# Altium schematic sheet 27_WR_PTP.SchDoc: White Rabbit PTP
size A3; Organization: Lime Microsystems; Address1: Surrey Tech Centre; Address2: Guildford GU2 7YG; Address3: Surrey; Address4: United Kingdom; DocumentNumber: 16; Revision: v1.0; SheetNumber: 27; SheetTotal: 31
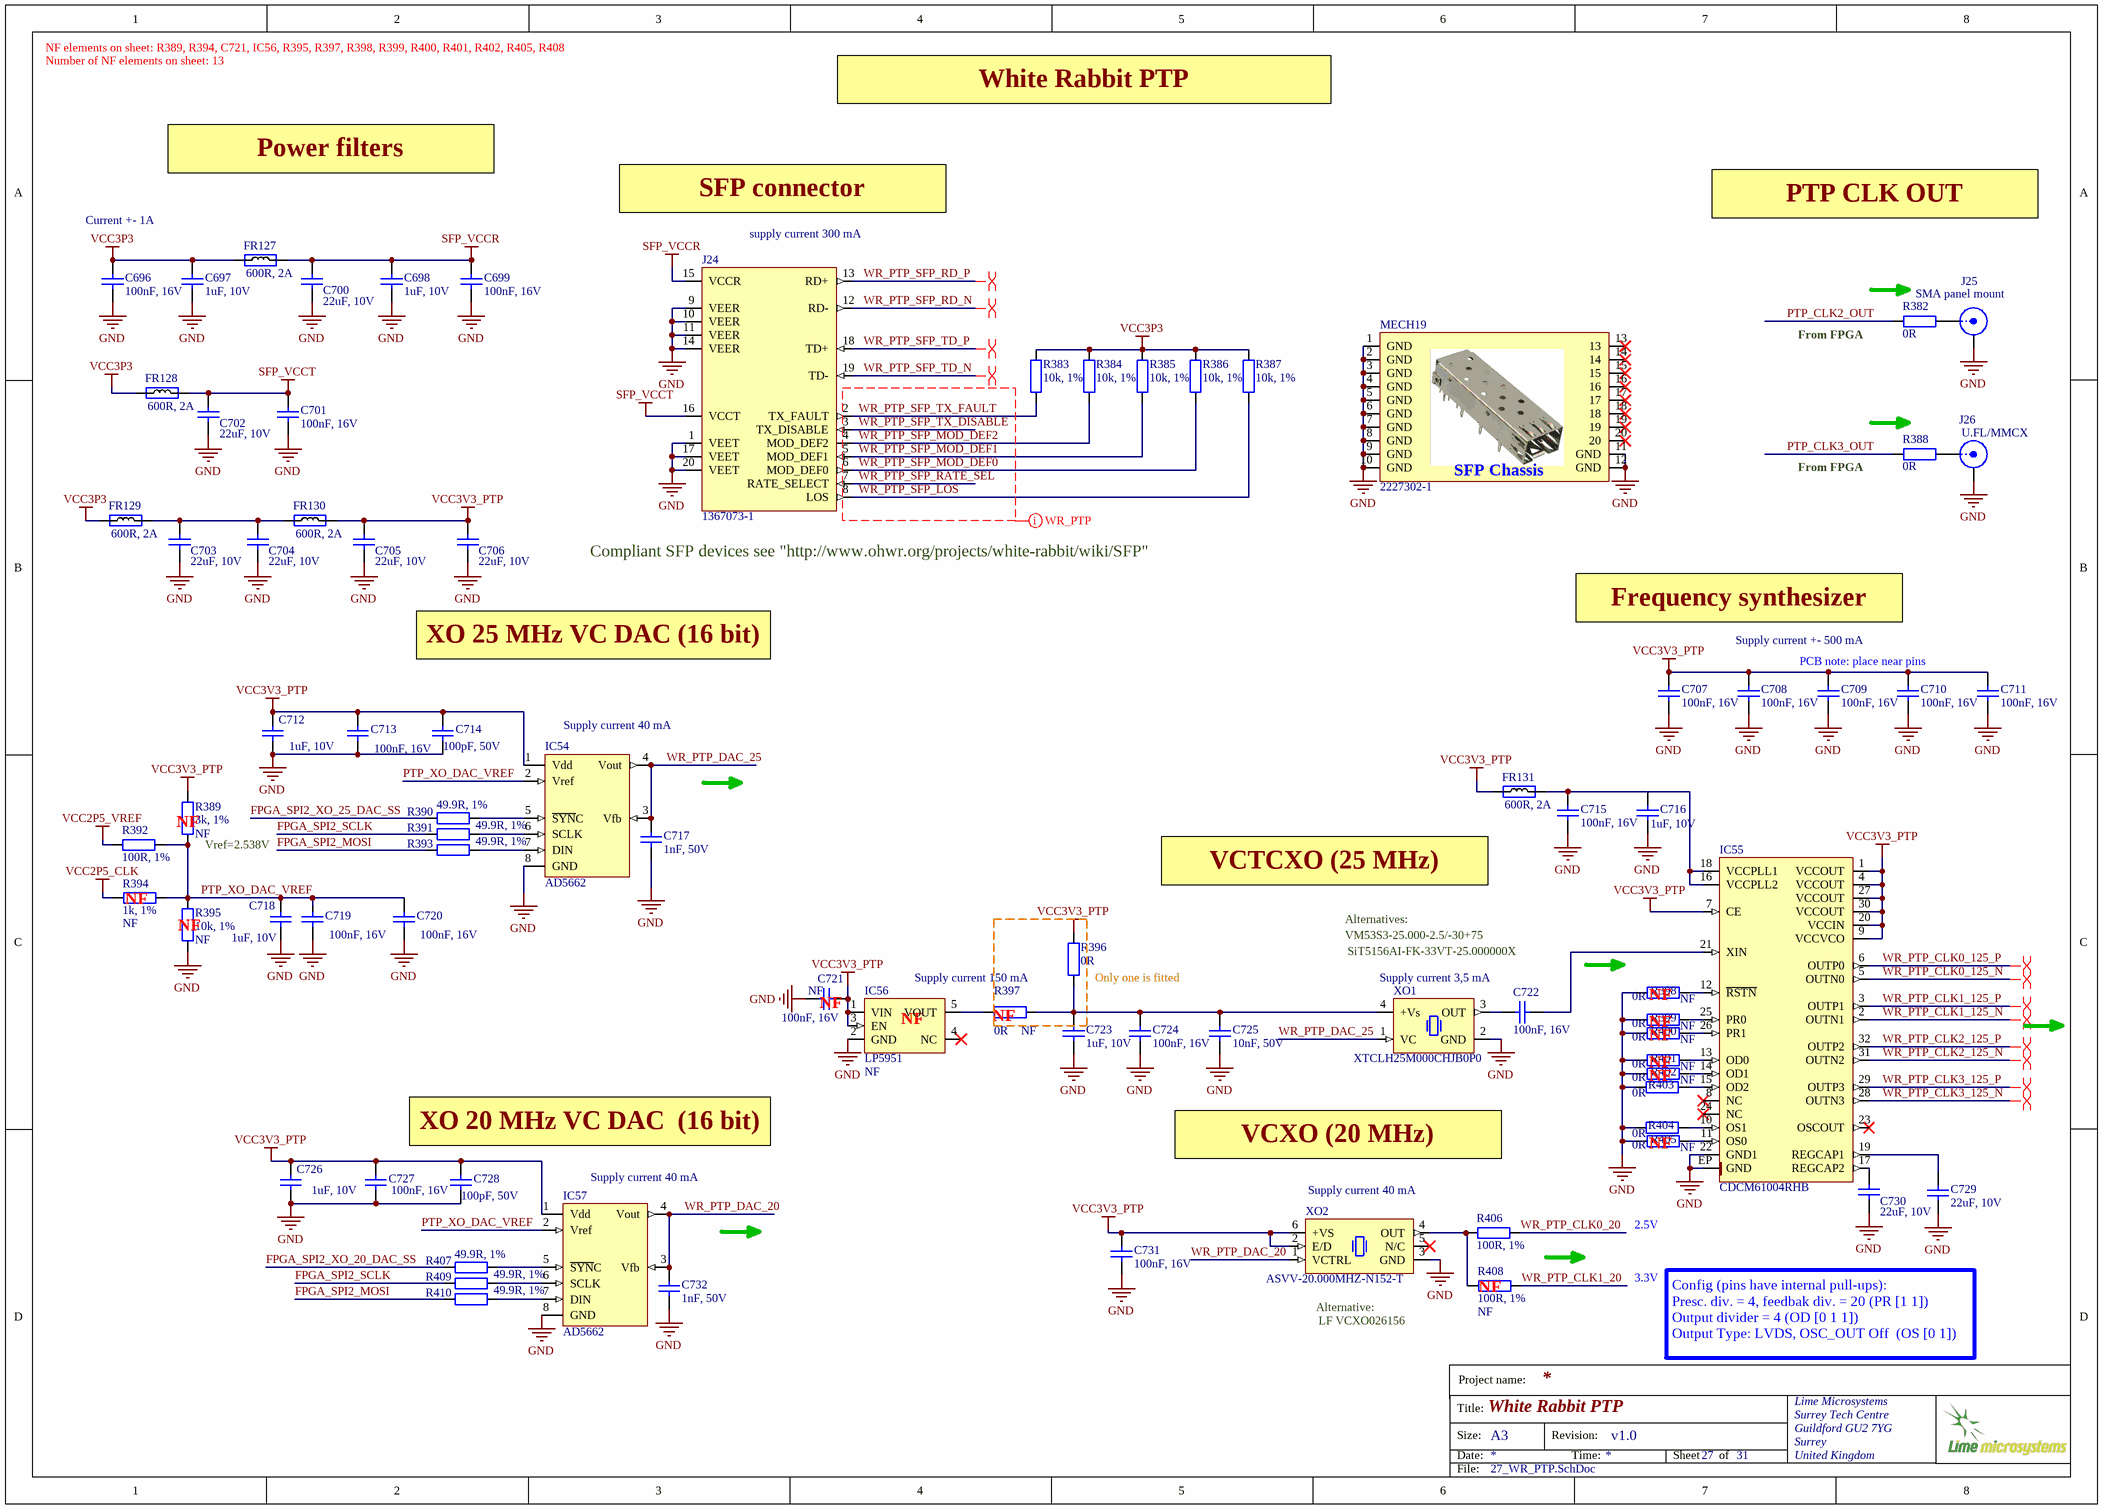
[diagram p0: 27_WR_PTP.SchDoc]

## Parts
C696  100nF, 16V  [CAP0402]
C697  1uF, 10V  [CAP0402]
C698  1uF, 10V  [CAP0402]
C699  100nF, 16V  [CAP0402]
C700  22uF, 10V  [CAP0603]
C701  100nF, 16V  [CAP0402]
C702  22uF, 10V  [CAP0603]
C703  22uF, 10V  [CAP0603]
C704  22uF, 10V  [CAP0603]
C705  22uF, 10V  [CAP0603]
C706  22uF, 10V  [CAP0603]
C707  100nF, 16V  [CAP0402]
C708  100nF, 16V  [CAP0402]
C709  100nF, 16V  [CAP0402]
C710  100nF, 16V  [CAP0402]
C711  100nF, 16V  [CAP0402]
C712  1uF, 10V  [CAP0402]
C713  100nF, 16V  [CAP0402]
C714  100pF, 50V  [CAP0402]
C715  100nF, 16V  [CAP0402]
C716  1uF, 10V  [CAP0402]
C717  1nF, 50V  [CAP0402]
C718  1uF, 10V  [CAP0402]
C719  100nF, 16V  [CAP0402]
C720  100nF, 16V  [CAP0402]
C721  100nF, 16V  Assembly Info: NF  [CAP0402]
C722  100nF, 16V  [CAP0402]
C723  1uF, 10V  [CAP0402]
C724  100nF, 16V  [CAP0402]
C725  10nF, 50V  [CAP0402]
C726  1uF, 10V  [CAP0402]
C727  100nF, 16V  [CAP0402]
C728  100pF, 50V  [CAP0402]
C729  22uF, 10V  [CAP0603]
C730  22uF, 10V  [CAP0603]
C731  100nF, 16V  [CAP0402]
C732  1nF, 50V  [CAP0402]
FR127  600R, 2A  [RES0805]
FR128  600R, 2A  [RES0805]
FR129  600R, 2A  [RES0805]
FR130  600R, 2A  [RES0805]
FR131  600R, 2A  [RES0805]
IC54  AD5662  [AD5662_SOT23-8]
IC55  CDCM61004RHB  [CDCM61004RHB_CLK_GEN_VQFN32]
IC56  LP5951  Assembly Info: NF  [LP5951MF_SOT23-5]
IC57  AD5662  [AD5662_SOT23-8]
J24  1367073-1  [SFP_CON_x1_1367073-1]
J25  SMA panel mount  [SMA_connector_side]
J26  U.FL/MMCX  [MMCX_UFL_conn_u]
MECH19  2227302-1  [SFP_Chassis_22273021]
R382  0R  [RES0402]
R383  10k, 1%  [RES0402]
R384  10k, 1%  [RES0402]
R385  10k, 1%  [RES0402]
R386  10k, 1%  [RES0402]
R387  10k, 1%  [RES0402]
R388  0R  [RES0402]
R389  3k, 1%  Assembly Info: NF  [RES0402]
R390  49.9R, 1%  [RES0402]
R391  49.9R, 1%  [RES0402]
R392  100R, 1%  [RES0402]
R393  49.9R, 1%  [RES0402]
R394  1k, 1%  Assembly Info: NF  [RES0402]
R395  10k, 1%  Assembly Info: NF  [RES0402]
R396  0R  [RES0402]
R397  0R  Assembly Info: NF  [RES0402]
R398  0R  Assembly Info: NF  [RES0402]
R399  0R  Assembly Info: NF  [RES0402]
R400  0R  Assembly Info: NF  [RES0402]
R401  0R  Assembly Info: NF  [RES0402]
R402  0R  Assembly Info: NF  [RES0402]
R403  0R  [RES0402]
R404  0R  [RES0402]
R405  0R  Assembly Info: NF  [RES0402]
R406  100R, 1%  [RES0402]
R407  49.9R, 1%  [RES0402]
R408  100R, 1%  Assembly Info: NF  [RES0402]
R409  49.9R, 1%  [RES0402]
R410  49.9R, 1%  [RES0402]
XO1  XTCLH25M000CHJB0P0  [XO_XTCLH25M000CHJB0P0]
XO2  ASVV-20.000MHZ-N152-T  [XO_ASVV-20.000MHZ-N152-T]

## Nets
GND: C696.1 C697.1 C698.1 C699.1 C700.1 C701.1 C702.1 C703.1 C704.1 C705.1 C706.1 C707.1 C708.1 C709.1 C710.1 C711.1 C712.1 C713.2 C714.2 C715.1 C716.1 C717.2 C718.1 C719.2 C720.2 C721.1 C723.1 C724.1 C725.2 C726.1 C727.2 C728.2 C729.2 C730.1 C731.1 C732.2 IC54.8(GND) IC55.22(GND1) IC55.EP(GND) IC56.2(GND) IC57.8(GND) J24.1(VEET) J24.9(VEER) J24.10(VEER) J24.11(VEER) J24.14(VEER) J24.17(VEET) J24.20(VEET) J25.2(Y) J26.2(Y) MECH19.1(GND) MECH19.2(GND) MECH19.3(GND) MECH19.4(GND) MECH19.5(GND) MECH19.6(GND) MECH19.7(GND) MECH19.8(GND) MECH19.9(GND) MECH19.10(GND) MECH19.11(GND) MECH19.12(GND) R395.2 R398.2 R399.2 R400.2 R401.2 R402.2 R403.1 R404.1 R405.2 XO1.2(GND) XO2.3(GND)
SFP_VCCR: C698.2 C699.2 C700.2 FR127.2 J24.15(VCCR)
SFP_VCCT: C701.2 C702.2 FR128.2 J24.16(VCCT)
VCC2P5_CLK: R394.2
VCC2P5_VREF: R392.1
VCC3P3: C696.2 C697.2 FR127.1 FR128.1 FR129.1 R383.1 R384.1 R385.1 R386.1 R387.1
VCC3V3_PTP: C705.2 C706.2 C707.2 C708.2 C709.2 C710.2 C711.2 C712.2 C713.1 C714.1 C721.2 C726.2 C727.1 C728.1 C731.2 FR130.2 FR131.1 IC54.1(Vdd) IC55.1(VCCOUT) IC55.4(VCCOUT) IC55.7(CE) IC55.9(VCCVCO) IC55.20(VCCIN) IC55.27(VCCOUT) IC55.30(VCCOUT) IC56.1(VIN) IC56.3(EN) IC57.1(Vdd) R389.2 R396.1 XO2.2(E/D) XO2.6(+VS)
FPGA_SPI2_MOSI: R393.2 R410.2
FPGA_SPI2_SCLK: R391.2 R409.2
FPGA_SPI2_XO_20_DAC_SS: R407.2
FPGA_SPI2_XO_25_DAC_SS: R390.2
PTP_CLK2_OUT: R382.2
PTP_CLK3_OUT: R388.2
PTP_XO_DAC_VREF: C718.2 C719.1 C720.1 IC54.2(Vref) IC57.2(Vref) R389.1 R392.2 R394.1 R395.1
WR_PTP_CLK0_20: R406.1
WR_PTP_CLK0_125_N: IC55.5(OUTN0)
WR_PTP_CLK0_125_P: IC55.6(OUTP0)
WR_PTP_CLK1_20: R408.1
WR_PTP_CLK1_125_N: IC55.2(OUTN1)
WR_PTP_CLK1_125_P: IC55.3(OUTP1)
WR_PTP_CLK2_125_N: IC55.31(OUTN2)
WR_PTP_CLK2_125_P: IC55.32(OUTP2)
WR_PTP_CLK3_125_N: IC55.28(OUTN3)
WR_PTP_CLK3_125_P: IC55.29(OUTP3)
WR_PTP_DAC_20: C732.1 IC57.3(Vfb) IC57.4(Vout) XO2.1(VCTRL)
WR_PTP_DAC_25: C717.1 IC54.3(Vfb) IC54.4(Vout) XO1.1(VC)
WR_PTP_SFP_LOS: J24.8(LOS) R387.2
WR_PTP_SFP_MOD_DEF0: J24.6(MOD_DEF0) R386.2
WR_PTP_SFP_MOD_DEF1: J24.5(MOD_DEF1) R385.2
WR_PTP_SFP_MOD_DEF2: J24.4(MOD_DEF2) R384.2
WR_PTP_SFP_RATE_SEL: J24.7(RATE_SELECT)
WR_PTP_SFP_RD_N: J24.12(RD-)
WR_PTP_SFP_RD_P: J24.13(RD+)
WR_PTP_SFP_TD_N: J24.19(TD-)
WR_PTP_SFP_TD_P: J24.18(TD+)
WR_PTP_SFP_TX_DISABLE: J24.3(TX_DISABLE)
WR_PTP_SFP_TX_FAULT: J24.2(TX_FAULT) R383.2
NetC703_2: C703.2 C704.2 FR129.2 FR130.1
NetC715_2: C715.2 C716.2 FR131.2 IC55.16(VCCPLL2) IC55.18(VCCPLL1)
NetC722_1: C722.1 IC55.21(XIN)
NetC722_2: C722.2 XO1.3(OUT)
NetC723_2: C723.2 C724.2 C725.1 R396.2 R397.1 XO1.4(+Vs)
NetC729_1: C729.1 IC55.19(REGCAP1)
NetC730_2: C730.2 IC55.17(REGCAP2)
NetIC54_5: IC54.5(~{SYN}C) R390.1
NetIC54_6: IC54.6(SCLK) R391.1
NetIC54_7: IC54.7(DIN) R393.1
NetIC55_10: IC55.10(OS1) R404.2
NetIC55_11: IC55.11(OS0) R405.1
NetIC55_12: IC55.12(~{RSTN}) R398.1
NetIC55_13: IC55.13(OD0) R401.1
NetIC55_14: IC55.14(OD1) R402.1
NetIC55_15: IC55.15(OD2) R403.2
NetIC55_25: IC55.25(PR0) R399.1
NetIC55_26: IC55.26(PR1) R400.1
NetIC56_5: IC56.5(VOUT) R397.2
NetIC57_5: IC57.5(~{SYN}C) R407.1
NetIC57_6: IC57.6(SCLK) R409.1
NetIC57_7: IC57.7(DIN) R410.1
NetJ25_1: J25.1(X) R382.1
NetJ26_1: J26.1(X) R388.1
NetR406_2: R406.2 R408.2 XO2.4(OUT)

Not connected (* = marked no-connect by the designer): IC55 8(NC)* 23(OSCOUT)* 24(NC)*; IC56 4(NC)*; MECH19 13* 14* 15* 16* 17* 18* 19* 20*; XO2 5(N/C)*

## Layout directives
differential pair: WR_PTP_CLK0_125_N, WR_PTP_CLK0_125_P, WR_PTP_CLK1_125_N, WR_PTP_CLK1_125_P, WR_PTP_CLK2_125_N, WR_PTP_CLK2_125_P, WR_PTP_CLK3_125_N, WR_PTP_CLK3_125_P, WR_PTP_SFP_RD_N, WR_PTP_SFP_RD_P, WR_PTP_SFP_TD_N, WR_PTP_SFP_TD_P
net class WR_PTP: WR_PTP_SFP_LOS, WR_PTP_SFP_MOD_DEF0, WR_PTP_SFP_MOD_DEF1, WR_PTP_SFP_MOD_DEF2, WR_PTP_SFP_RATE_SEL, WR_PTP_SFP_TX_DISABLE, WR_PTP_SFP_TX_FAULT

## Notes on the sheet
- Number of NF elements on sheet: 13
- NF elements on sheet: R389, R394, C721, IC56, R395, R397, R398, R399, R400, R401, R402, R405, R408
- White Rabbit PTP
- Power filters
- Current +- 1A
- SFP connector
- (near J24) supply current 300 mA
- PTP CLK OUT
- (near R382) From FPGA
- (near MECH19) SFP Chassis
- (near R388) From FPGA
- (near J24) Compliant SFP devices see "http://www.ohwr.org/projects/white-rabbit/wiki/SFP"
- XO 25 MHz VC DAC (16 bit)
- Frequency synthesizer
- Supply current +- 500 mA
- PCB note: place near pins
- (near IC54) Supply current 40 mA
- (near R389) NF
- (near R389) Vref=2.538V
- (near R394) NF
- (near FR131) VCTCXO (25 MHz)
- Alternatives:
- (near R395) NF
- Supply current 150 mA
- (near R396) Only one is fitted
- VM53S3-25.000-2.5/-30+75
- SiT5156AI-FK-33VT-25.000000X
- Supply current 3,5 mA
- (near C721) NF
- (near IC56) NF
- (near R397) NF
- (near R398) NF
- NF
- XO 20 MHz VC DAC  (16 bit)
- (near IC57) Supply current 40 mA
- VCXO (20 MHz)
- (near XO2) Supply current 40 mA
- 2.5V
- (near XO2) Alternative:
- LF VCXO026156
- (near R408) NF
- 3.3V
- Config (pins have internal pull-ups):
  Presc. div. = 4, feedbak div. = 20 (PR [1 1])
  Output divider = 4 (OD [0 1 1])
  Output Type: LVDS, OSC_OUT Off  (OS [0 1])
- Project name:
- Title:
- Size:
- Date:
- A3
- Revision:
- Time:
- Sheet
- of
- File:

## Library data of the parts
C696 C699 C701 C707-C711 C715 C721 C722 C724 C731 = Cap_0402: Manufacturer: Murata Electronics; Manufacturer Part Number 1: GRM155R71C104KA88D; Part Description: 0.10µF ±10% 16V X7R Ceramic Capacitor -55°C ~ 125°C Surface Mount, MLCC 0402 (1005 Metric) 0.039" L x 0.020" W (1.00mm x 0.50mm); Tolerance: 10 %; Type: General Purpose MLCC; Capacitance: 0.1 uF; Case Length: 1 mm; Dielectric: X7R; Case Height: 0.5 mm; Temperature Coefficient / Code: +/- 15 %; Value: 100nF, 16V; Supplier 1: Mouser; Supplier Part Number 1: 81-GRM155R71C104KA88; Case Code - in: 0402; RoHS: RoHS Compliant; Operating Temperature Range: - 55 C to + 125 C; Series: GRM; Termination Style: SMD/SMT; Package / Case: 0402 (1005 metric); Voltage Rating DC: 16 V; Maximum Operating Temperature: + 125 C; Case Code - mm: 1005; Minimum Operating Temperature: - 55 C; Product Category: Low & Medium Capacitance SMD Ceramic Chip Capacitors; Packaging: Reel; Product: General Type MLCCs; Category: Multilayer Ceramic Capacitors MLCC - SMD/SMT; Brand: Murata Electronics; Case Width: 0.5 mm; RoHS - Mouser: Y; Standard Pack Qty: 10000; Minimum Order Quantity: 1; Reeling: True
C697 C698 C712 C716 C718 C723 C726 = Cap_0402: Manufacturer Part Number 1: C1005X5R1E105K050BC; Manufacturer: TDK; Part Description: 1µF ±10% 10V X5R Ceramic Capacitor -55°C ~ 85°C Surface Mount, MLCC 0402 (1005 Metric) 0.039" L x 0.020" W (1.00mm x 0.50mm); Voltage Rating: 10; Capacitance: 1; Capacitance Tolerance: ± 10%; Ceramic Capacitor Case: 0402 [1005 Metric]; Dielectric Characteristic: X6; Product Range: TDK - C Series; Value: 1uF, 10V; Supplier 1: Digi-Key; Supplier Part Number 1: 445-9066-1-ND; MSL: -; RoHS: YES
C700 C702-C706 C729 C730 = Cap_0603: Manufacturer Part Number 1: C1608X5R1A226M080AC; Manufacturer: TDK Corporation; Part Description: 22µF ±20% 10V X5R Ceramic Capacitor -55°C ~ 85°C Surface Mount, MLCC 0603 (1608 Metric) 0.063" L x 0.031" W (1.60mm x 0.80mm); Brand: TDK; Temperature Coefficient / Code: +/- 15 %; Tolerance: 20 %; Type: Multilayer Ceramic Chip Capacitor; Supplier 1: Mouser; Supplier Part Number 1: 810-C1608X5R1A226M; Package / Case: 0603 (1608 metric); Category: Multilayer Ceramic Capacitors MLCC - SMD/SMT; Capacitance: 22 uF; Operating Temperature Range: - 55 C to + 85 C; Case Code - in: 0603; Voltage Rating DC: 10 V; Case Code - mm: 1608; Value: 22uF, 10V
C713 C719 C720 C727 = Cap_0603: Manufacturer Part Number 1: GRM155R71C104KA88D; Part Description: 0.10µF ±10% 16V X7R Ceramic Capacitor -55°C ~ 125°C Surface Mount, MLCC 0402 (1005 Metric) 0.039" L x 0.020" W (1.00mm x 0.50mm); Brand: Murata Electronics; Tolerance: 10 %; Type: General Purpose MLCC; Capacitance: 0.1 uF; Temperature Coefficient / Code: +/- 15 %; Case Height: 0.5 mm; Case Length: 1 mm; Dielectric: X7R; Supplier 1: Mouser; Supplier Part Number 1: 81-GRM155R71C104KA88; Case Code - in: 0402; Manufacturer: Murata Electronics; Category: Multilayer Ceramic Capacitors MLCC - SMD/SMT; Voltage Rating DC: 16 V; Value: 100nF, 16V; Case Code - mm: 1005; Case Width: 0.5 mm; Maximum Operating Temperature: + 125 C; Minimum Operating Temperature: - 55 C; Minimum Order Quantity: 1; Operating Temperature Range: - 55 C to + 125 C; Package / Case: 0402 (1005 metric); Packaging: Reel; Product: General Type MLCCs; Product Category: Low & Medium Capacitance SMD Ceramic Chip Capacitors; Reeling: True; RoHS - Mouser: Y; RoHS: RoHS Compliant; Series: GRM; Standard Pack Qty: 10000; Termination Style: SMD/SMT
C714 C728 = Cap_0402: Manufacturer: Yageo; Manufacturer Part Number 1: CC0402JRNPO9BN101; Part Description: 100pF ±5% 50V C0G, NP0 Ceramic Capacitor -55°C ~ 125°C Surface Mount, MLCC 0402 (1005 Metric) 0.039" L x 0.020" W (1.00mm x 0.50mm); Temperature Coefficient: C0G, NP0; Tolerance: ±5%; Value: 100pF, 50V; Supplier 1: Digi-Key; Supplier Part Number 1: 311-1024-1-ND; Category: Capacitors; Features: -; Operating Temperature: -55°C ~ 125°C; Capacitance: 100pF; Thickness (Max): 0.022" (0.55mm); RoHS: RoHS Compliant; Voltage - Rated: 50V; Lead Style: -; Ratings: -; Size / Dimension: 0.039" L x 0.020" W (1.00mm x 0.50mm); Height - Seated (Max): -; Applications: General Purpose; Package / Case: 0402 (1005 Metric); Lead Spacing: -; Packaging: Tape & Reel (TR); Mounting Type: Surface Mount, MLCC
C717 C732 = Cap_0402: Manufacturer Part Number 1: GCM155R71H102KA37D; Part Description: 1000pF ±10% 50V X7R Ceramic Capacitor -55°C ~ 125°C Surface Mount, MLCC 0402 (1005 Metric) 0.039" L x 0.020" W (1.00mm x 0.50mm); Capacitance: 1000 pF; Type: Automotive Ultra Small MLCC; Tolerance: 10 %; Brand: Murata Electronics; Case Height: 0.5 mm; Case Length: 1 mm; Dielectric: X7R; Temperature Coefficient / Code: +/- 15 %; Value: 1nF, 50V; Supplier 1: Mouser; Supplier Part Number 1: 81-GCM155R71H102KA7D; Case Code - in: 0402; Package / Case: 0402 (1005 metric); Termination Style: SMD/SMT; Packaging: Reel; Operating Temperature Range: - 55 C to + 125 C; Maximum Operating Temperature: + 125 C; Manufacturer: Murata Electronics; Category: Multilayer Ceramic Capacitors MLCC - SMD/SMT; RoHS: RoHS Compliant; Series: GCM; Case Width: 0.5 mm; Voltage Rating DC: 50 V; Case Code - mm: 1005; Product: Automotive MLCCs; Standard Pack Qty: 10000; Reeling: True; RoHS - Mouser: Y; Minimum Order Quantity: 1; Product Category: Automotive Ceramic Chip Capacitors; Minimum Operating Temperature: - 55 C
C725 = Cap_0402: Part Description: 10000pF ±10% 50V Ceramic Capacitor X7R 0402 (1005 Metric); Manufacturer: Murata Electronics North America; Manufacturer Part Number 1: GRM155R71H103KA88D; Tolerance: ±10%; Temperature Coefficient: X7R; Value: 10nF, 50V; Supplier 1: Digi-Key; Supplier Part Number 1: 490-4516-2-ND; RoHS: RoHS Compliant; Category: Capacitors; Stock 1: 10970000; Pricing 1: 10000=0.00185, 20000=0.00176, 30000=0.00167 (USD); Packaging: Tape & Reel (TR); Part Status: Active; Voltage - Rated: 50V; Operating Temperature: -55°C ~ 125°C; Features: -; Ratings: -; Applications: General Purpose; Mounting Type: Surface Mount, MLCC; Package / Case: 0402 (1005 Metric); Size / Dimension: 0.039" L x 0.020" W (1.00mm x 0.50mm); Height - Seated (Max): -; Thickness (Max): 0.022" (0.55mm); Lead Spacing: -; Lead Style: -; ComponentLink1URL: http://www.murata.com/~/media/webrenewal/support/library/catalog/products/capacitor/mlcc/c02e.ashx?la=en-us; ComponentLink1Description: http://www.murata.com/~/media/webrenewal/support/library/catalog/products/capacitor/mlcc/c02e.ashx?la=en-us
FR127-FR131 = Ferrite: Manufacturer Part Number 1: MPZ2012S601AT000; Manufacturer: TDK Corporation; Part Description: FERRITE BEAD 600 OHM 0805 1LN; Filter Type: Differential Mode - Single; Impedance @ Frequency: 600 Ohm @ 100MHz; DC Resistance (DCR): 100 mOhm Max; Supplier 1: Digi-Key; Supplier Part Number 1: 445-2206-2-ND; Mounting Type: Surface Mount; RoHS: RoHS Compliant; Height (Max): 0.041" (1.05mm); Packaging: Tape & Reel (TR); Category: Filters; Current Rating: 2A; Package / Case: 0805 (2012 Metric); Size / Dimension: 0.079" L x 0.049" W (2.00mm x 1.25mm); Value: 600R, 2A
IC54 IC57 = AD5662: Manufacturer: Analog Devices Inc.; Manufacturer Part Number 1: AD5662BRJZ-2REEL7; Part Description: IC DAC 16BIT BUFF V-OUT SOT23-8; Number of Bits: 16; Number of D/A Converters: 1; Settling Time: 10µs; Output Type: Voltage - Buffered; Differential Output: No; Data Interface: SPI, DSP; Reference Type: External; Voltage - Supply, Analog: 2.7 V ~ 5.5 V; INL/DNL (LSB): ±8, ±1 (Max); Architecture: String DAC; Supplier 1: Digi-Key; RoHS: RoHS Compliant; Category: Integrated Circuits (ICs); Stock 1: 2784; Pricing 1: 1=7.55, 10=6.821, 100=5.6469, 500=4.91722, 1000=4.28274 (USD); Packaging: Cut Tape (CT); Part Status: Active; Voltage - Supply, Digital: 2.7 V ~ 5.5 V; Operating Temperature: -40°C ~ 125°C; Package / Case: SOT-23-8; Supplier Device Package: SOT-23-8; ComponentLink1URL: http://www.analog.com/media/en/technical-documentation/data-sheets/AD5662.pdf; ComponentLink1Description: http://www.analog.com/media/en/technical-documentation/data-sheets/AD5662.pdf; Supplier Part Number 1: AD5662BRJZ-2REEL7CT-ND
IC55 = CDCM61004RHB_CLK_GEN: Part Description: Clock Generator IC 683.27MHz 32-VFQFN Exposed Pad; Manufacturer: Texas Instruments; Manufacturer Part Number 1: CDCM61004RHBT; Frequency: 683.28MHz; Number of Outputs: 4; Nominal Supply Current: 215mA; Number of Elements: 1; Min Supply Voltage: 3V; Max Supply Voltage: 3.6V; Operating Supply Voltage: 3.3V; Max Frequency: 683.27MHz; Operating Supply Current: 108mA; Max Supply Current: 65mA; Input: Crystal; Input Current: 200mA; Supplier 1: Digi-Key; Supplier Part Number 1: 296-24194-1-ND; Stock 1: 1415; Pricing 1: 1=9,06000, 10=8,18800, 25=7,80760, 100=6,77930 (USD); RoHS: Yes; Mount: Surface Mount; Case/Package: VQFN; Number of Pins: 32; Weight: 0.002547oz; Contact Plating: Gold; Min Operating Temperature: -40°C; Max Operating Temperature: 85°C; Packaging: Tape and Reel; Package Quantity: 1; Number of Circuits: 1; Termination: SMD/SMT; Length: 5mm; Width: 5mm; Height: 0.8mm; Radiation Hardening: No; REACH SVHC: No SVHC; Lead Free: Lead Free; RoHS Compliant: Yes; ComponentLink1URL: https://datasheet.ciiva.com/6677/cdcm61004-6677168.pdf?src-supplier=Digi-Key; ComponentLink1Description: https://datasheet.ciiva.com/6677/cdcm61004-6677168.pdf?src-supplier=Digi-Key; ComponentLink2URL: https://datasheet.ciiva.com/14247/cdcm61004-14247059.pdf?src-supplier=Avnet; ComponentLink2Description: https://datasheet.ciiva.com/14247/cdcm61004-14247059.pdf?src-supplier=Avnet; ComponentLink3URL: https://datasheet.ciiva.com/1138/1781794-1138868.pdf?src-supplier=Element14; ComponentLink3Description: https://datasheet.ciiva.com/1138/1781794-1138868.pdf?src-supplier=Element14; ComponentLink4URL: https://datasheet.ciiva.com/26033/cdcm61004-26033080.pdf?src-supplier=Avnet+Europe; ComponentLink4Description: https://datasheet.ciiva.com/26033/cdcm61004-26033080.pdf?src-supplier=Avnet+Europe; ComponentLink5URL: https://datasheet.ciiva.com/14247/cdcm61004-14247241.pdf?src-supplier=Avnet; ComponentLink5Description: https://datasheet.ciiva.com/14247/cdcm61004-14247241.pdf?src-supplier=Avnet; ComponentLink6URL: https://datasheet.ciiva.com/46396/1781794-46396315.pdf?src-supplier=Element14; ComponentLink6Description: https://datasheet.ciiva.com/46396/1781794-46396315.pdf?src-supplier=Element14; ComponentLink7URL: https://datasheet.ciiva.com/1141/cdcm61004-1141260.pdf?src-supplier=Farnell; ComponentLink7Description: https://datasheet.ciiva.com/1141/cdcm61004-1141260.pdf?src-supplier=Farnell; ComponentLink8URL: https://datasheet.ciiva.com/15153/getdatasheetpartid-226426-15153388.pdf?src-supplier=Verical; ComponentLink8Description: https://datasheet.ciiva.com/15153/getdatasheetpartid-226426-15153388.pdf?src-supplier=Verical; ComponentLink9URL: https://datasheet.ciiva.com/46433/1781794-46433420.pdf?src-supplier=Element14; ComponentLink9Description: https://datasheet.ciiva.com/46433/1781794-46433420.pdf?src-supplier=Element14; ComponentLink10URL: https://datasheet.ciiva.com/1200/cdcm61004-1200223.pdf?src-supplier=Digi-Key; ComponentLink10Description: https://datasheet.ciiva.com/1200/cdcm61004-1200223.pdf?src-supplier=Digi-Key
IC56 = LP5951_LDO: Part Description: Linear Voltage Regulator IC Output 150mA SOT-23-5; Manufacturer: TI National Semiconductor; Manufacturer Part Number 1: LP5951MF-3.0/NOPB; Max Output Current: 150mA; Output Voltage: 3V; Number of Outputs: 1; Min Input Voltage: 1.8V; Max Input Voltage: 5.5V; Dropout Voltage: 200mV; Min Output Voltage: 1.3V; Max Output Voltage: 3.7V; Polarity: Positive; Quiescent Current: 55uA; Accuracy: 2%; Output Type: Fixed,Adjustable; Supplier 1: Digi-Key; Supplier Part Number 1: LP5951MF-3.0/NOPBCT-ND; Stock 1: 8756; Pricing 1: 1=0,80000, 10=0,70000, 25=0,65720, 100=0,53640, 250=0,49820, 500=0,42400 (USD); RoHS: Yes; Mount: Surface Mount; Case/Package: SOT-23; Number of Pins: 5; Min Operating Temperature: -40°C; Max Operating Temperature: 125°C; Package Quantity: 1000; Output Current: 150mA; Packaging: Tape and Reel; Nominal Output Voltage: 3V; Max Supply Voltage: 5.5V; Min Supply Voltage: 1.8V; Termination: SMD/SMT; Output Voltage Accuracy: 2%; Length: 2.92mm; Width: 1.6mm; Height: 1.02mm; Radiation Hardening: No; REACH SVHC: No SVHC; Lead Free: Lead Free; RoHS Compliant: Yes; ComponentLink1URL: https://datasheet.ciiva.com/15111/getdatasheetpartid-86470-15111508.pdf?src-supplier=Verical; ComponentLink1Description: https://datasheet.ciiva.com/15111/getdatasheetpartid-86470-15111508.pdf?src-supplier=Verical; ComponentLink2URL: https://datasheet.ciiva.com/6598/lp5951-6598089.pdf?src-supplier=Digi-Key; ComponentLink2Description: https://datasheet.ciiva.com/6598/lp5951-6598089.pdf?src-supplier=Digi-Key; ComponentLink3URL: https://datasheet.ciiva.com/6598/lp5951-6598090.pdf?src-supplier=Digi-Key; ComponentLink3Description: https://datasheet.ciiva.com/6598/lp5951-6598090.pdf?src-supplier=Digi-Key; ComponentLink4URL: https://datasheet.ciiva.com/6598/lp5951-6598091.pdf?src-supplier=Digi-Key; ComponentLink4Description: https://datasheet.ciiva.com/6598/lp5951-6598091.pdf?src-supplier=Digi-Key; ComponentLink5URL: https://datasheet.ciiva.com/48777/1772311-48777743.pdf?src-supplier=Element14; ComponentLink5Description: https://datasheet.ciiva.com/48777/1772311-48777743.pdf?src-supplier=Element14
J24 = SFPx1_Connector: Manufacturer: TE Connectivity; Part Description: 20 Position SFP Receptacle Connector Solder Surface Mount, Right Angle; Connector Type: Receptacle,SFP; Number of Ports: 1; Gender: Female; Number of Contacts: 20; Data Rate: 4Gbps; Max Voltage Rating (AC): 120V; Pitch: 0.8mm; Plating Thickness: 0.38um; Supplier 1: Digi-Key; Supplier Part Number 1: A97430CT-ND; Manufacturer Part Number 1: 1367073-1; Stock 1: 16529; Pricing 1: 1=1,77000, 10=1,60800, 25=1,51000, 50=1,44440, 100=1,37870 (USD); RoHS: Yes; Mount: Surface Mount; Contact Material: Bronze,Gold; Contact Plating: Gold; Material: Polymer,Liquid Crystal Polymer; Housing Material: Polymer; Color: Black; Housing Color: Black; Min Operating Temperature: -55°C; Max Operating Temperature: 85°C; Package Quantity: 480; Packaging: Tape and Reel; Termination: SMD/SMT; Orientation: Right Angle; Number of Positions: 20; Number of Positions Loaded: 20; Length: 11.2mm; Depth: 7.4mm; Radiation Hardening: No; Lead Free: Lead Free; ELV: Compliant; REACH SVHC: Unknown; Flammability Rating: UL94 V-0; ComponentLink1URL: https://datasheet.ciiva.com/689/eng-cd-1367073-k-689473.pdf?src-supplier=Digi-Key; ComponentLink1Description: https://datasheet.ciiva.com/689/eng-cd-1367073-k-689473.pdf?src-supplier=Digi-Key; ComponentLink2URL: https://datasheet.ciiva.com/26824/getdatasheetpartid-111150-26824248.pdf?src-supplier=Verical; ComponentLink2Description: https://datasheet.ciiva.com/26824/getdatasheetpartid-111150-26824248.pdf?src-supplier=Verical; ComponentLink3URL: https://datasheet.ciiva.com/16314/eng-cs-1773408-1-pluggable-ixo-solutions-sfp-0409-16314846.pdf?src-supplier=Future+Electronics; ComponentLink3Description: https://datasheet.ciiva.com/16314/eng-cs-1773408-1-pluggable-ixo-solutions-sfp-0409-16314846.pdf?src-supplier=Future+Electronics; ComponentLink4URL: https://datasheet.ciiva.com/14159/1367073-eng-tds-14159446.pdf?src-supplier=Distrelec; ComponentLink4Description: https://datasheet.ciiva.com/14159/1367073-eng-tds-14159446.pdf?src-supplier=Distrelec; ComponentLink5URL: https://datasheet.ciiva.com/11757/0900766b80db5732-11757313.pdf?src-supplier=RSComponents; ComponentLink5Description: https://datasheet.ciiva.com/11757/0900766b80db5732-11757313.pdf?src-supplier=RSComponents; ComponentLink6URL: https://datasheet.ciiva.com/1099/1509426-1099442.pdf?src-supplier=Newark; ComponentLink6Description: https://datasheet.ciiva.com/1099/1509426-1099442.pdf?src-supplier=Newark; ComponentLink7URL: https://datasheet.ciiva.com/689/eng-cd-1367073-k-689475.pdf?src-supplier=Digi-Key; ComponentLink7Description: https://datasheet.ciiva.com/689/eng-cd-1367073-k-689475.pdf?src-supplier=Digi-Key; ComponentLink8URL: https://datasheet.ciiva.com/1098/1650946-1098067.pdf?src-supplier=Element14; ComponentLink8Description: https://datasheet.ciiva.com/1098/1650946-1098067.pdf?src-supplier=Element14; ComponentLink9URL: https://datasheet.ciiva.com/3138/eng-cs-1773408-1-pluggable-ixo-solutions-sfp-0409-3138613.pdf?src-supplier=Avnet; ComponentLink9Description: https://datasheet.ciiva.com/3138/eng-cs-1773408-1-pluggable-ixo-solutions-sfp-0409-3138613.pdf?src-supplier=Avnet; ComponentLink10URL: https://datasheet.ciiva.com/3138/eng-cs-1773408-1-pluggable-ixo-solutions-sfp-0409-3138614.pdf?src-supplier=Avnet; ComponentLink10Description: https://datasheet.ciiva.com/3138/eng-cs-1773408-1-pluggable-ixo-solutions-sfp-0409-3138614.pdf?src-supplier=Avnet; ComponentLink11URL: https://datasheet.ciiva.com/689/eng-cd-1367073-k-689474.pdf?src-supplier=Digi-Key; ComponentLink11Description: https://datasheet.ciiva.com/689/eng-cd-1367073-k-689474.pdf?src-supplier=Digi-Key; ComponentLink12URL: https://datasheet.ciiva.com/46391/1794467-46391366.pdf?src-supplier=Element14; ComponentLink12Description: https://datasheet.ciiva.com/46391/1794467-46391366.pdf?src-supplier=Element14; ComponentLink13URL: https://datasheet.ciiva.com/28795/1759364-28795367.pdf?src-supplier=Element14; ComponentLink13Description: https://datasheet.ciiva.com/28795/1759364-28795367.pdf?src-supplier=Element14; ComponentLink14URL: https://datasheet.ciiva.com/30155/eng-cs-1773408-1-pluggable-ixo-solutions-sfp-0409-30155864.pdf?src-supplier=Onlinecomponents.com; ComponentLink14Description: https://datasheet.ciiva.com/30155/eng-cs-1773408-1-pluggable-ixo-solutions-sfp-0409-30155864.pdf?src-supplier=Onlinecomponents.com; ComponentLink15URL: https://datasheet.ciiva.com/22652/1650946-22652219.pdf?src-supplier=Farnell; ComponentLink15Description: https://datasheet.ciiva.com/22652/1650946-22652219.pdf?src-supplier=Farnell; ComponentLink16URL: https://datasheet.ciiva.com/25908/eng-cs-1773408-1-pluggable-ixo-solutions-sfp-0409-25908701.pdf?src-supplier=Avnet+Europe; ComponentLink16Description: https://datasheet.ciiva.com/25908/eng-cs-1773408-1-pluggable-ixo-solutions-sfp-0409-25908701.pdf?src-supplier=Avnet+Europe; ComponentLink17URL: https://datasheet.ciiva.com/16469/eng-cs-1773408-1-pluggable-ixo-solutions-sfp-0409-16469439.pdf?src-supplier=Avnet+Asia; ComponentLink17Description: https://datasheet.ciiva.com/16469/eng-cs-1773408-1-pluggable-ixo-solutions-sfp-0409-16469439.pdf?src-supplier=Avnet+Asia
J25 = RF_IF_connector: CONN SMA JACK STR 50OHM EDGE MNT; Manufacturer: Linx; Manufacturer Part Number 1: CONSMA002-L-G; Part Description: SMA Connector Receptacle, Female Socket 50Ohm Panel Mount, Through Hole, Right Angle Solder; Supplier 1: Digi-Key; Supplier Part Number 1: CONSMA002-L-G-ND; Stock 1: 815; Pricing 1: 1=4.08, 25=3.67, 100=3.32, 250=3.25, 500=3, 1000=2.80001, 2000=2.5875 (USD)
J26 = RF_IF_connector: CONN UMC RCPT STR 50 OHM SMD; Manufacturer: Molex, LLC; Manufacturer Part Number 1: 0734120110; Body Finish: Nickel; Body Material: Phosphor Bronze; Center Contact Material: Brass; Center Contact Plating: Gold; Connector Style: Ultra Miniature Coaxial; Connector Type: Jack, Male Pin; Contact Termination: Solder; Dielectric Material: Liquid Crystal Polymer (LCP); Frequency - Max: 6GHz; Impedance: 50 Ohm; Voltage Rating: 60V; Cable Group: -; Category: Connectors, Interconnects; Fastening Type: Snap-On; Features: -; Housing Color: Silver; Ingress Protection: -; Mounting Type: Surface Mount; Operating Temperature: -40°C ~ 90°C; Packaging: Cut Tape (CT); RoHS: RoHS Compliant; Shield Termination: Solder; Supplier 1: Digi-Key; Supplier Part Number 1: WM5587CT-ND; Part Description: CONN UMC RCPT STR 50 OHM SMD
MECH19 = SFPx1_Chassis: Part Description: - Position SFP Cage Connector Press-Fit Through Hole, Right Angle; Manufacturer: TE Connectivity AMP; Data Rate: 4Gbps; Number of Ports: 1; PCB Thickness: 0.059inch; Tail Length: 3mm; Supplier 1: Digi-Key; Supplier Part Number 1: A120616-ND; Manufacturer Part Number 1: 2227302-1; Stock 1: 16113; Pricing 1: 1=1,43000, 10=1,26100, 25=1,18720, 40=1,13750, 192=1,08813, 384=0,98922, 576=0,89030, 960=0,79138, 2496=0,71718 (USD); RoHS: Yes; Mount: Through Hole; Packaging: Tray; Termination: Press-Fit; Length: 14.5mm; ELV: Compliant; RoHS Compliant: Yes; ComponentLink1URL: https://datasheet.ciiva.com/45236/eng-cd-2227302-1-45236428.pdf?src-supplier=Avnet; ComponentLink1Description: https://datasheet.ciiva.com/45236/eng-cd-2227302-1-45236428.pdf?src-supplier=Avnet
R382 R388 R396-R405 = Res_0402: Manufacturer Part Number 1: RC0402JR-070RL; Manufacturer: Yageo; Part Description: RES SMD 0.0OHM JUMPER 1/16W 0402; Resistance (Ohms): 0.0; Tolerance: Jumper; Power (Watts): 0.063W, 1/16W; Value: 0R; Supplier 1: Digi-Key; Supplier Part Number 1: 311-0.0JRTR-ND; Category: Resistors; Temperature Coefficient: -; Features: Moisture Resistant; Supplier Device Package: 0402; Height: 0.016" (0.40mm); Package / Case: 0402 (1005 Metric); Operating Temperature: -55°C ~ 155°C; Size / Dimension: 0.039" L x 0.020" W (1.00mm x 0.50mm); Composition: Thick Film; Packaging: Tape & Reel (TR); Number of Terminations: 2; RoHS: RoHS Compliant
R383-R387 R395 = Res_0402: Manufacturer: Yageo; Manufacturer Part Number 1: RC0402FR-0710KL; Part Description: RES SMD 10K OHM 1% 1/16W 0402; Temperature Coefficient: ±100ppm/°C; Power (Watts): 0.063W, 1/16W; Value: 10k, 1%; Supplier 1: Digi-Key; Supplier Part Number 1: 311-10.0KLRTR-ND; Resistance (Ohms): 10k; Packaging: Tape & Reel (TR); RoHS: RoHS Compliant; Package / Case: 0402 (1005 Metric); Tolerance: ±1%; Operating Temperature: -55°C ~ 155°C; Size / Dimension: 0.039" L x 0.020" W (1.00mm x 0.50mm); Number of Terminations: 2; Category: Resistors; Height: 0.016" (0.40mm); Supplier Device Package: 0402; Features: Moisture Resistant; Composition: Thick Film
R389 = Res_0402: Manufacturer: Vishay Dale; Part Description: RES SMD 3K OHM 1% 1/16W 0402; Manufacturer Part Number 1: CRCW04023K00FKED; Temperature Coefficient: ±100ppm/°C; Power (Watts): 0.063W, 1/16W; Value: 3k, 1%; Category: Resistors; Tolerance: ±1%; RoHS: RoHS Compliant; Composition: Thick Film; Number of Terminations: 2; Operating Temperature: -55°C ~ 155°C; Supplier Device Package: 0402 (1005 Metric); Supplier Part Number 1: 541-3.00KLCT-ND; Packaging: Cut Tape (CT); Supplier 1: Digi-Key; Package / Case: 0402 (1005 Metric); Features: Automotive AEC-Q200; Resistance (Ohms): 3k; Height: 0.016" (0.40mm); Size / Dimension: 0.039" L x 0.020" W (1.00mm x 0.50mm)
R390 R391 R393 R407 R409 R410 = Res_0402: Manufacturer: Samsung Electro-Mechanics America, Inc.; Part Description: RES SMD 49.9 OHM 1% 1/16W 0402; Manufacturer Part Number 1: RC1005F49R9CS; Temperature Coefficient: ±100ppm/°C; Resistance (Ohms): 49.9; Power (Watts): 0.063W, 1/16W; Number of Terminations: 2; Size / Dimension: 0.039" L x 0.020" W (1.00mm x 0.50mm); Supplier Device Package: 0402 (1005 Metric); RoHS: RoHS Compliant; Supplier Part Number 1: 1276-3469-6-ND; Features: -; Packaging: Digi-Reel®; Tolerance: ±1%; Height: 0.016" (0.40mm); Category: Resistors; Composition: Thick Film; Package / Case: 0402 (1005 Metric); Supplier 1: Digi-Key; Operating Temperature: -55°C ~ 155°C; Value: 49.9R, 1%
R392 = Res_0402: Manufacturer Part Number 1: RMCF0402FT100R; Part Description: RES SMD 100 OHM 1% 1/16W 0402; Manufacturer: Stackpole Electronics Inc.; Temperature Coefficient: ±100ppm/°C; Supplier 1: Digi-Key; Supplier Part Number 1: RMCF0402FT100RDKR-ND; Package / Case: 0402 (1005 Metric); Composition: Thick Film; Category: Resistors; Tolerance: ±1%; Value: 100R, 1%
R394 = Res_0402: Manufacturer: Stackpole Electronics Inc; Manufacturer Part Number 1: RMCF0402FT1K00; Part Description: RES SMD 1K OHM 1% 1/16W 0402; Temperature Coefficient: ±100ppm/°C; Power (Watts): 0.063W, 1/16W; Value: 1k, 1%; Supplier 1: Digi-Key; Supplier Part Number 1: RMCF0402FT1K00TR-ND; Resistance (Ohms): 1k; Packaging: Tape & Reel (TR); Category: Resistors; RoHS: RoHS Compliant; Tolerance: ±1%; Height: 0.016" (0.40mm); Number of Terminations: 2; Package / Case: 0402 (1005 Metric); Operating Temperature: -55°C ~ 155°C; Features: -; Composition: Thick Film; Supplier Device Package: 0402; Size / Dimension: 0.039" L x 0.020" W (1.00mm x 0.50mm)
R406 R408 = Res_0402: Manufacturer Part Number 1: RMCF0402FT100R; Manufacturer: Stackpole Electronics Inc.; Part Description: RES SMD 100 OHM 1% 1/16W 0402; Power (Watts): 0.063W, 1/16W; Temperature Coefficient: ±100ppm/°C; Resistance (Ohms): 100; Value: 100R, 1%; Supplier 1: Digi-Key; Supplier Part Number 1: RMCF0402FT100RDKR-ND; Packaging: Digi-Reel®; Composition: Thick Film; Number of Terminations: 2; Package / Case: 0402 (1005 Metric); RoHS: RoHS Compliant; Category: Resistors; Size / Dimension: 0.039" L x 0.020" W (1.00mm x 0.50mm); Tolerance: ±1%; Supplier Device Package: 0402; Features: -; Height: 0.016" (0.40mm); Operating Temperature: -55°C ~ 155°C
XO1 = Oscillator XTCLH25M000CHJB0P0: Manufacturer: Murata; Part Description: XTAL OSC VCTCXO 25.0000MHZ CMOS; Supplier 1: Digi-Key; Stock 1: 1960; Pricing 1: 1=10,11000, 10=9,48000, 50=9,16400, 100=8,84800, 500=8,53200, 1000=7,90000 (USD); Supplier Part Number 1: 490-XTCLH25M000CHJB0P0CT-ND; Manufacturer Part Number 1: XTCLH25M000CHJB0P0
XO2 = Oscillator ASVV-20.000MHZ-N152-T: Manufacturer: Abracon; Part Description: XTAL OSC VCXO 20.0000MHZ CMOS; Frequency: 20MHz; Load Capacitance: 30pF; Operating Supply Voltage: 3.3V; Max Supply Voltage: 3.465V; Min Supply Voltage: 3.135V; Max Supply Current: 15mA; Frequency Stability: 50ppm; Max Duty Cycle: 60%; Supplier 1: Digi-Key; Stock 1: 1109; Pricing 1: 1=4,74000, 10=4,49300, 50=4,24320, 100=3,99360, 500=3,86880 (USD); Mount: Surface Mount; Case/Package: SMD/SMT; Number of Pins: 6; Min Operating Temperature: 0°C; Max Operating Temperature: 70°C; Packaging: Tape and Reel; Package Quantity: 1000; Termination: SMD/SMT; Series: ASVV; Length: 0.276inch; Width: 0.197inch; Height: 0.079inch; Depth: 5mm; Radiation Hardening: No; Lead Free: Lead Free; RoHS Compliant: No; ComponentLink1URL: https://datasheet.ciiva.com/867/asvv-867044.pdf?src-supplier=Digi-Key; ComponentLink1Description: https://datasheet.ciiva.com/867/asvv-867044.pdf?src-supplier=Digi-Key; Supplier Part Number 1: 535-9344-1-ND; Manufacturer Part Number 1: ASVV-20.000MHZ-N152-T; RoHS: Yes; ComponentLink2URL: https://datasheet.ciiva.com/867/asvv-867045.pdf?src-supplier=Digi-Key; ComponentLink2Description: https://datasheet.ciiva.com/867/asvv-867045.pdf?src-supplier=Digi-Key; ComponentLink3URL: https://datasheet.ciiva.com/867/asvv-867046.pdf?src-supplier=Digi-Key; ComponentLink3Description: https://datasheet.ciiva.com/867/asvv-867046.pdf?src-supplier=Digi-Key